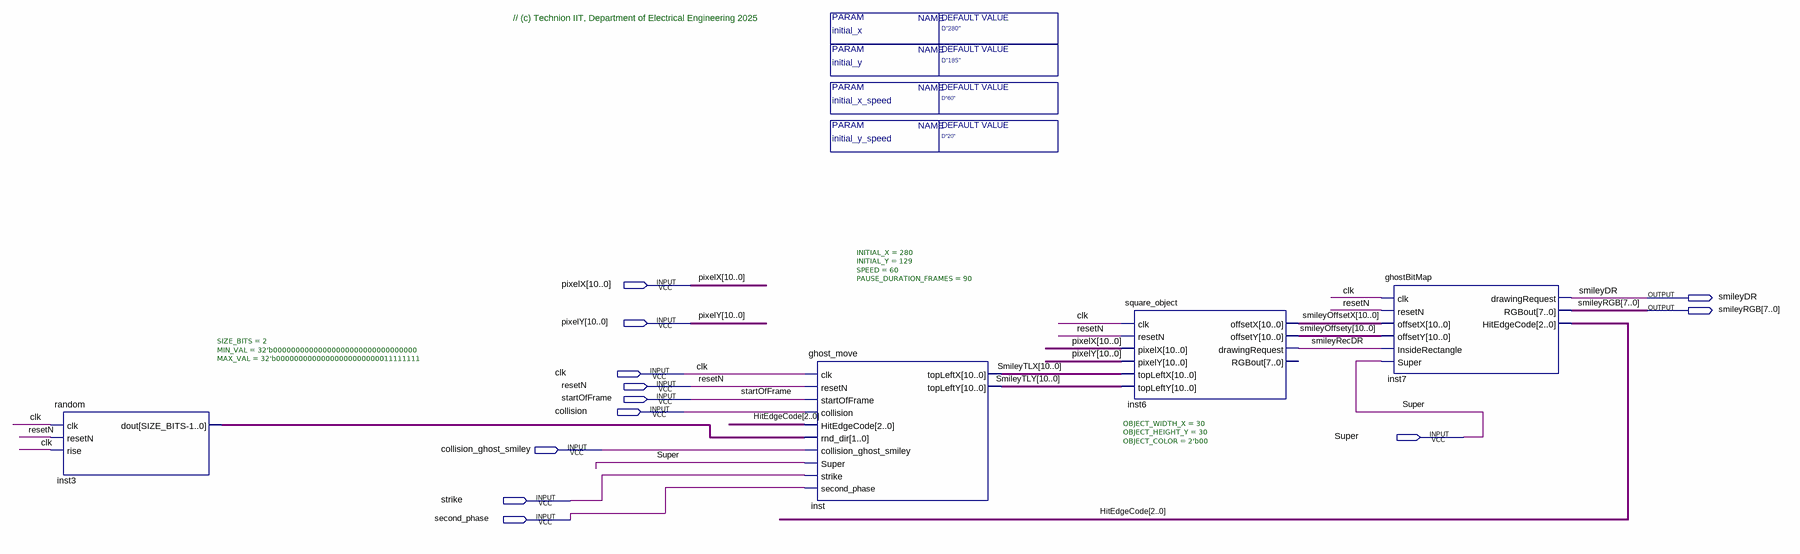
[diagram p0: schematic sheet]
// Quartus schematic Ghost_Block_T.bdf as structural Verilog: 4 symbols, 12 pins
module Ghost_Block_T #(parameter initial_x = "D\"280\"", parameter initial_y = "D\"185\"", parameter initial_x_speed = "D\"60\"", parameter initial_y_speed = "D\"20\"") (
  input  [10:0] pixelX,
  input  [10:0] pixelY,
  input  clk,
  input  resetN,
  input  startOfFrame,
  input  collision,
  input  Super,
  input  collision_ghost_smiley,
  input  strike,
  input  second_phase,
  output smileyDR,
  output [7:0] smileyRGB
);

  wire smileyRecDR;
  wire [1:0] inst3_dout;
  wire [2:0] HitEdgeCode;
  wire [10:0] smileyOffsetX, smileyOffsety, SmileyTLX, SmileyTLY;

  random #(.SIZE_BITS(2), .MIN_VAL(32'b00000000000000000000000000000000), .MAX_VAL(32'b00000000000000000000000011111111)) inst3 (
    .clk(clk), .resetN(resetN), .rise(clk), .dout(inst3_dout));
  ghost_move #(.INITIAL_X(280), .INITIAL_Y(129), .SPEED(60), .PAUSE_DURATION_FRAMES(90)) inst (
    .clk(clk), .resetN(resetN), .startOfFrame(startOfFrame), .collision(collision),
    .HitEdgeCode(HitEdgeCode), .rnd_dir(inst3_dout), .collision_ghost_smiley(collision_ghost_smiley),
    .Super(Super), .strike(strike), .second_phase(second_phase), .topLeftX(SmileyTLX), .topLeftY(SmileyTLY));
  square_object #(.OBJECT_WIDTH_X(30), .OBJECT_HEIGHT_Y(30), .OBJECT_COLOR(2'b00)) inst6 (
    .clk(clk), .resetN(resetN), .pixelX(pixelX), .pixelY(pixelY), .topLeftX(SmileyTLX), .topLeftY(SmileyTLY),
    .offsetX(smileyOffsetX), .offsetY(smileyOffsety), .drawingRequest(smileyRecDR));  // open: RGBout
  ghostBitMap inst7 (
    .clk(clk), .resetN(resetN), .offsetX(smileyOffsetX), .offsetY(smileyOffsety),
    .InsideRectangle(smileyRecDR), .Super(Super), .drawingRequest(smileyDR), .RGBout(smileyRGB),
    .HitEdgeCode(HitEdgeCode));

  // Notes on the sheet:
  //   // (c) Technion IIT, Department of Electrical Engineering 2025
endmodule
